# Altium project VCU_DV.PrjPcb
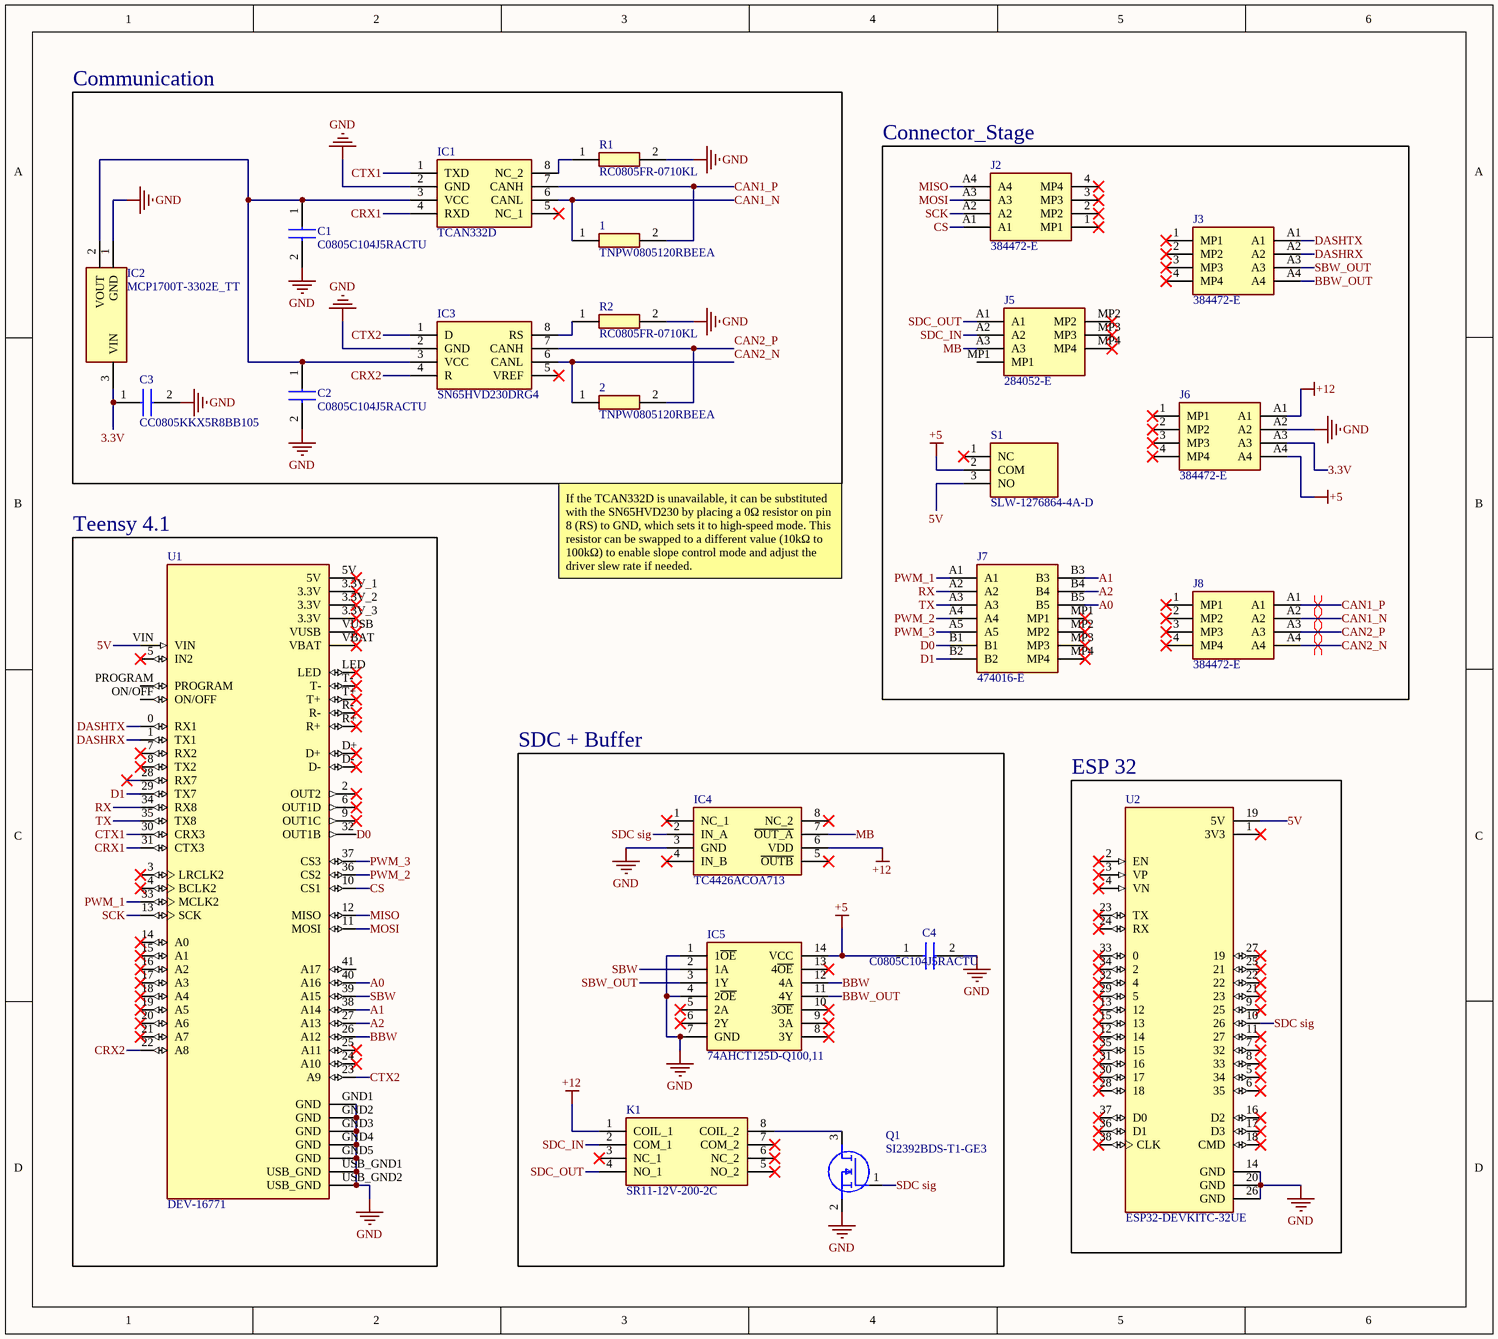
[diagram p0: VCU_DV.SchDoc]
1 sheet, 24 parts. Net scope: global (net labels, ports and power ports of the same name join across sheets).
Board file: VCU_DV.PcbDoc

## Sheet VCU_DV.SchDoc
size 279 x 250 mm; SheetNumber: 1; SheetTotal: 1

### Parts
1  TNPW0805120RBEEA  [RESC2012X55N]
2  TNPW0805120RBEEA  [RESC2012X55N]
C1  C0805C104J5RACTU  [C0805]
C2  C0805C104J5RACTU  [C0805]
C3  CC0805KKX5R8BB105  [CAPC2012X145N]
C4  C0805C104J5RACTU  [C0805]
IC1  TCAN332D  [TCAN332D]
IC2  MCP1700T-3302E_TT  [SOT95P237X112-3N]
IC3  SN65HVD230DRG4  [SOIC127P600X175-8N]
IC4  TC4426ACOA713  [SOIC127P600X175-8N]
IC5  74AHCT125D-Q100,11  [SOIC127P600X175-14N]
J2  384472-E  [384472E]
J3  384472-E  [384472E]
J5  284052-E  [284052E]
J6  384472-E  [384472E]
J7  474016-E  [474016E]
J8  384472-E  [384472E]
K1  SR11-12V-200-2C  [SR1112V2002C]
Q1  SI2392BDS-T1-GE3  [SOT95P237X112-3N]
R1  RC0805FR-0710KL  [RESC2012X60N]
R2  RC0805FR-0710KL  [RESC2012X60N]
S1  SLW-1276864-4A-D  [SLW12768644AD]
U1  DEV-16771  [MODULE_DEV-16771]
U2  ESP32-DEVKITC-32UE  [ESPRESSIF_ESP32-DEVKITC-32UE]

### Blocks framed on the sheet
Communication: 1 2 C1-C3 IC1-IC3 R1 R2
Connector_Stage: J2 J3 J5-J8 S1
Teensy 4.1: U1
SDC + Buffer: C4 IC4 IC5 K1 Q1
ESP 32: U2

### Nets
+5: C4.1 IC5.14(VCC) J6.A4 S1.2(COM)
+12: IC4.6(VDD) J6.A1 K1.1(COIL_1)
GND: C1.2 C2.2 C3.2 C4.2 IC1.2(GND) IC2.1(GND) IC3.2(GND) IC4.3(GND) IC5.1(1~{OE}) IC5.4(2~{OE}) IC5.7(GND) J6.A2 Q1.2(S) R1.2 R2.2 U1.GND1(GND) U1.GND2(GND) U1.GND3(GND) U1.GND4(GND) U1.GND5(GND) U1.USB_GND1(USB_GND) U1.USB_GND2(USB_GND) U2.14(GND) U2.20(GND) U2.26(GND)
3.3V: C3.1 IC2.3(VIN) J6.A3
5V: S1.3(NO) U1.VIN U2.19(5V)
A0: J7.B5 U1.40(A16)
A1: J7.B3 U1.38(A14)
A2: J7.B4 U1.27(A13)
BBW: IC5.12(4A) U1.26(A12)
BBW_OUT: IC5.11(4Y) J3.A4
CAN1_N: 1.1 IC1.6(CANL) J8.A2
CAN1_P: 1.2 IC1.7(CANH) J8.A1
CAN2_N: 2.1 IC3.6(CANL) J8.A4
CAN2_P: 2.2 IC3.7(CANH) J8.A3
CRX1: IC1.4(RXD) U1.31(CTX3)
CRX2: IC3.4(R) U1.22(A8)
CS: J2.A1 U1.10(CS1)
CTX1: IC1.1(TXD) U1.30(CRX3)
CTX2: IC3.1(D) U1.23(A9)
D0: J7.B1 U1.32(OUT1B)
D1: J7.B2 U1.29(TX7)
DASHRX: J3.A2 U1.1(TX1)
DASHTX: J3.A1 U1.0(RX1)
MB: IC4.7(~{OUT_A}) J5.A3
MISO: J2.A4 U1.12(MISO)
MOSI: J2.A3 U1.11(MOSI)
PWM_1: J7.A1 U1.33(MCLK2)
PWM_2: J7.A4 U1.36(CS2)
PWM_3: J7.A5 U1.37(CS3)
RX: J7.A2 U1.34(RX8)
SBW: IC5.2(1A) U1.39(A15)
SBW_OUT: IC5.3(1Y) J3.A3
SCK: J2.A2 U1.13(SCK)
SDC sig: IC4.2(IN_A) Q1.1(G) U2.10(26)
SDC_IN: J5.A2 K1.2(COM_1)
SDC_OUT: J5.A1 K1.4(NO_1)
TX: J7.A3 U1.35(TX8)
NetC1_1: C1.1 C2.1 IC1.3(VCC) IC2.2(VOUT) IC3.3(VCC)
NetIC1_8: IC1.8(NC_2) R1.1
NetIC3_8: IC3.8(RS) R2.1
NetK1_8: K1.8(COIL_2) Q1.3(D)

Not connected (* = marked no-connect by the designer): IC1 5(NC_1)*; IC3 5(VREF)*; IC4 1(NC_1)* 4(IN_B)* 5(~{OUTB})* 8(NC_2)*; IC5 5(2A)* 6(2Y)* 8(3Y)* 9(3A)* 10(3~{OE})* 13(4~{OE})*; J2 1(MP1)* 2(MP2)* 3(MP3)* 4(MP4)*; J3 1(MP1)* 2(MP2)* 3(MP3)* 4(MP4)*; J5 MP1 MP2* MP3* MP4*; J6 1(MP1)* 2(MP2)* 3(MP3)* 4(MP4)*; J7 MP1* MP2* MP3* MP4*; J8 1(MP1)* 2(MP2)* 3(MP3)* 4(MP4)*; K1 3(NC_1)* 5(NO_2)* 6(NC_2)* 7(COM_2)*; S1 1(NC)*; U1 2(OUT2)* 3(LRCLK2)* 3.3V_1(3.3V)* 3.3V_2(3.3V)* 3.3V_3(3.3V)* 4(BCLK2)* 5(IN2)* 5V* 6(OUT1D)* 7(RX2)* 8(TX2)* 9(OUT1C)* 14(A0)* 15(A1)* 16(A2)* 17(A3)* 18(A4)* 19(A5)* 20(A6)* 21(A7)* 24(A10)* 25(A11)* 28(RX7)* 41(A17) D+* D-* LED* ON/OFF PROGRAM R+* R-* T+* T-* VBAT* VUSB*; U2 1(3V3)* 2(EN)* 3(VP)* 4(VN)* 5(34)* 6(35)* 7(32)* 8(33)* 9(25)* 11(27)* 12(14)* 13(12)* 15(13)* 16(D2)* 17(D3)* 18(CMD)* 21(23)* 22* 23(TX)* 24(RX)* 25(21)* 27(19)* 28(18)* 29(5)* 30(17)* 31(16)* 32(4)* 33(0)* 34(2)* 35(15)* 36(D1)* 37(D0)* 38(CLK)*

### Layout directives
differential pair: CAN1_N, CAN1_P, CAN2_N, CAN2_P

### Notes on the sheet
- If the TCAN332D is unavailable, it can be substituted with the SN65HVD230 by placing a 0Ω resistor on pin 8 (RS) to GND, which sets it to high-speed mode. This resistor can be swapped to a different value (10kΩ to 100kΩ) to enable slope control mode and adjust the driver slew rate if needed.

### Library data of the parts
1 2 = TNPW0805120RBEEA: Resistor; Manufacturer_Name: Vishay; Datasheet Link: https://www.vishay.com/docs/28758/tnpw_e3.pdf; Height: 0.55mm; Manufacturer_Part_Number: TNPW0805120RBEEA; Mouser Part Number: 71-TNPW0805120RBEEA; Mouser Price/Stock: https://www.mouser.co.uk/ProductDetail/Vishay-Dale/TNPW0805120RBEEA?qs=dafR6q3Fy0xDQ4ZX6i4Bqw%3D%3D
C1 C2 C4 = C0805C104J5RACTU: Capacitor; Manufacturer_Name: Yageo Group; Datasheet Link: https://www.yageogroup.com/content/datasheet/asset/file/KEM_C1002_X7R_SMD; Height: 1.1mm; Manufacturer_Part_Number: C0805C104J5RACTU; Mouser Part Number: 80-C0805C104J5R; Mouser Price/Stock: https://www.mouser.co.uk/ProductDetail/KEMET/C0805C104J5RACTU?qs=gbgtKHXraGH15GhoNPXHBg%3D%3D; Arrow Part Number: C0805C104J5RACTU; Arrow Price/Stock: https://www.arrow.com/en/products/c0805c104j5ractu/kemet-corporation?utm_currency=USD&region=nac
C3 = CC0805KKX5R8BB105: Capacitor; Manufacturer_Name: Yageo Group; Datasheet Link: https://www.mouser.cn/datasheet/2/447/yago_s_a0011397150_1-2286655.pdf; Height: 1.45mm; Manufacturer_Part_Number: CC0805KKX5R8BB105; Mouser Part Number: 603-CC805KKX5R8BB105; Mouser Price/Stock: https://www.mouser.co.uk/ProductDetail/YAGEO/CC0805KKX5R8BB105?qs=57cj7OiSijk1%252BH2OVk7C4Q%3D%3D; Arrow Part Number: CC0805KKX5R8BB105; Arrow Price/Stock: https://www.arrow.com/en/products/cc0805kkx5r8bb105/yageo?region=nac
IC1 = TCAN332D: Integrated Circuit; Manufacturer_Name: Texas Instruments; Datasheet Link: http://www.ti.com/lit/gpn/tcan332; Height: 1.75mm; Manufacturer_Part_Number: TCAN332D; Mouser Part Number: 595-TCAN332D; Mouser Price/Stock: https://www.mouser.co.uk/ProductDetail/Texas-Instruments/TCAN332D?qs=n%252BTO0c4TDSa%252BardrC1RUcw%3D%3D; Arrow Part Number: TCAN332D; Arrow Price/Stock: https://www.arrow.com/en/products/tcan332d/texas-instruments?utm_currency=USD&region=nac
IC2 = MCP1700T-3302E_TT: Integrated Circuit; Manufacturer_Name: Microchip; Manufacturer_Part_Number: MCP1700T-3302E/TT; Datasheet Link: https://datasheet.datasheetarchive.com/originals/distributors/SFDatasheet-4/sf-00090030.pdf; Height: 1.12mm; Mouser Part Number: 579-MCP1700T3302E/TT; Mouser Price/Stock: https://www.mouser.co.uk/ProductDetail/Microchip-Technology/MCP1700T-3302E-TT?qs=fM4xO01eazPmCNDrdHEdaw%3D%3D; Arrow Part Number: MCP1700T-3302E/TT; Arrow Price/Stock: https://www.arrow.com/en/products/mcp1700t-3302ett/microchip-technology.html?utm_currency=USD&region=nac
IC3 = SN65HVD230DRG4: Integrated Circuit; Manufacturer_Name: Texas Instruments; Datasheet Link: http://www.ti.com/general/docs/suppproductinfo.tsp?distId=10&gotoUrl=http%3A%2F%2Fwww.ti.com%2Flit%2Fgpn%2Fsn65hvd230; Height: 1.75mm; Manufacturer_Part_Number: SN65HVD230DRG4; Mouser Part Number: 595-SN65HVD230DRG4; Mouser Price/Stock: https://www.mouser.co.uk/ProductDetail/Texas-Instruments/SN65HVD230DRG4?qs=QViXGNcIEAvg9uZlAursSA%3D%3D; Arrow Part Number: SN65HVD230DRG4; Arrow Price/Stock: https://www.arrow.com/en/products/sn65hvd230drg4/texas-instruments?utm_currency=USD&region=nac
IC4 = TC4426ACOA713: Integrated Circuit; Manufacturer_Name: Microchip; Datasheet Link: http://www.microchip.com/mymicrochip/filehandler.aspx?ddocname=en011753; Height: 1.75mm; Manufacturer_Part_Number: TC4426ACOA713; Mouser Part Number: 579-TC4426ACOA713; Mouser Price/Stock: https://www.mouser.co.uk/ProductDetail/Microchip-Technology/TC4426ACOA713?qs=Y8sGFBEOzV8BTCfZE2iYhg%3D%3D; Arrow Part Number: TC4426ACOA713; Arrow Price/Stock: https://www.arrow.com/en/products/tc4426acoa713/microchip-technology?utm_currency=USD&region=nac
IC5 = 74AHCT125D-Q100,11: Integrated Circuit; Manufacturer_Name: Nexperia; Datasheet Link: https://assets.nexperia.com/documents/data-sheet/74AHC_AHCT125_Q100.pdf; Height: 1.75mm; Manufacturer_Part_Number: 74AHCT125D-Q100,11; Mouser Part Number: 771-74AHCT100D-Q100; Mouser Price/Stock: https://www.mouser.co.uk/ProductDetail/Nexperia/74AHCT125D-Q10011?qs=1sbE9T7hb3aFwEqQIQqpKg%3D%3D
J2 J3 J6 J8 = 384472-E: Connector; Manufacturer_Name: TE Connectivity; Datasheet Link: https://www.te.com/en/product-384472-E.html; Height: 5.05mm; Manufacturer_Part_Number: 384472-E
J5 = 284052-E: Connector; Manufacturer_Name: TE Connectivity; Datasheet Link: https://www.te.com/commerce/DocumentDelivery/DDEController?Action=showdoc&DocId=Customer+Drawing%7F224919-E%7FE%7Fpdf%7FEnglish%7FENG_CD_224919-E_E.pdf%7F284052-E; Height: 5.05mm; Manufacturer_Part_Number: 284052-E; Mouser Part Number: 305-284052; Mouser Price/Stock: https://www.mouser.co.uk/ProductDetail/TE-Connectivity-ERNI/284052-E?qs=t7xnP681wgU7xBo%252Bl2asHw%3D%3D; Arrow Part Number: 284052-E; Arrow Price/Stock: https://www.arrow.com/en/products/284052-e/te-connectivity?utm_currency=USD&region=nac
J7 = 474016-E: Connector; Manufacturer_Name: TE Connectivity; Datasheet Link: https://www.te.com/commerce/DocumentDelivery/DDEController?Action=showdoc&DocId=Customer+Drawing%7F324229-E-C%7FB1%7Fpdf%7FGerman%7FGER_CD_324229-E-C_B1.pdf%7F474016-E; Height: 7.99mm; Manufacturer_Part_Number: 474016-E; Mouser Part Number: 305-474016; Mouser Price/Stock: https://www.mouser.co.uk/ProductDetail/TE-Connectivity-ERNI/474016-E?qs=t7xnP681wgWap0JGLzibsA%3D%3D
K1 = SR11-12V-200-2C: Relay or Contactor; Manufacturer_Name: Same Sky; Datasheet Link: https://www.sameskydevices.com/product/resource/SR11-12V-200-2C.pdf; Height: 11.7mm; Manufacturer_Part_Number: SR11-12V-200-2C; Mouser Part Number: 179-SR11-12V-200-2C; Mouser Price/Stock: https://www.mouser.co.uk/ProductDetail/Same-Sky/SR11-12V-200-2C?qs=4ASt3YYao0UxXttxhS7S7A%3D%3D; Arrow Part Number: SR11-12V-200-2C; Arrow Price/Stock: https://www.arrow.com/en/products/sr11-12v-200-2c/cui-devices?utm_currency=USD&region=nac
Q1 = SI2392BDS-T1-GE3: MOSFET (N-Channel); Manufacturer_Name: Vishay; Datasheet Link: https://www.vishay.com/docs/62133/si2392bds.pdf; Height: 1.12mm; Manufacturer_Part_Number: SI2392BDS-T1-GE3; Mouser Part Number: 78-SI2392BDS; Mouser Price/Stock: https://www.mouser.co.uk/ProductDetail/Vishay-Siliconix/SI2392BDS-T1-GE3?qs=9vOqFld9vZU3PmPFM7QVvw%3D%3D; Arrow Part Number: SI2392BDS-T1-GE3; Arrow Price/Stock: https://www.arrow.com/en/products/si2392bds-t1-ge3/vishay?region=nac
R1 R2 = RC0805FR-0710KL: Resistor; Manufacturer_Name: Yageo Group; Datasheet Link: https://www.yageo.com/upload/media/product/productsearch/datasheet/rchip/PYu-RC_Group_51_RoHS_L_11.pdf; Height: 0.6mm; Manufacturer_Part_Number: RC0805FR-0710KL; Mouser Part Number: 603-RC0805FR-0710KL; Mouser Price/Stock: https://www.mouser.co.uk/ProductDetail/YAGEO/RC0805FR-0710KL?qs=7bY8808IzHq6vrU3BeiiYw%3D%3D; Arrow Part Number: RC0805FR-0710KL; Arrow Price/Stock: https://www.arrow.com/en/products/rc0805fr-0710kl/yageo.html?utm_currency=USD&region=europe
S1 = SLW-1276864-4A-D: Switch; Manufacturer_Name: Same Sky; Datasheet Link: https://www.sameskydevices.com/product/resource/slw-1276864-4a-d.pdf; Height: 10.6mm; Manufacturer_Part_Number: SLW-1276864-4A-D; Mouser Part Number: 179-SLW-1276864-4A-D; Mouser Price/Stock: https://www.mouser.co.uk/ProductDetail/Same-Sky/SLW-1276864-4A-D?qs=1Kr7Jg1SGW90vOt02EYiag%3D%3D; Arrow Part Number: SLW-1276864-4A-D; Arrow Price/Stock: https://www.arrow.com/en/products/slw-1276864-4a-d/cui-devices.html?utm_currency=USD&region=nac
U1 = DEV-16771: RT1062 Teensy 4.1 series ARM® Cortex®-M7 MPU Embedded Evaluation Board; MF: SparkFun Electronics; SnapEDA_Link: https://www.snapeda.com/parts/DEV-16771/SparkFun+Electronics/view-part/?ref=snap; Package: None; Value: *; MP: DEV-16771; Check_prices: https://www.snapeda.com/parts/DEV-16771/SparkFun+Electronics/view-part/?ref=eda
U2 = ESP32-DEVKITC-32UE: The ESP32-DEVKITC-32UE evaluation board from Espressif Systems is designed for seamless wireless connectivity in IoT applications. Powered by the ESP32-WROOM-32UE module, it supports dual-mode BluetoothÂ® Smart Ready 4.x and 802.11 b/g/n Wi-Fi at 2.4GHz.; SnapEDA_Link: https://www.snapeda.com/parts/ESP32-DEVKITC-32UE/Espressif+Systems/view-part/?ref=snap; Package: CUSTOM-38 ESPRESSIF; Value: *; MF: Espressif Systems; MP: ESP32-DEVKITC-32UE; Check_prices: https://www.snapeda.com/parts/ESP32-DEVKITC-32UE/Espressif+Systems/view-part/?ref=eda